# Altium schematic sheet USB_FPC.SchDoc
size A4
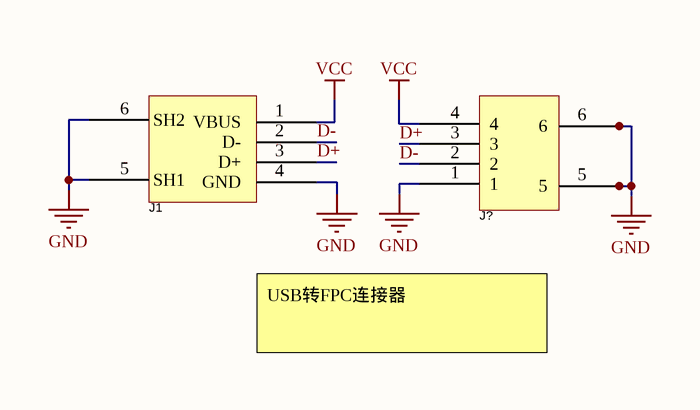
[diagram p0: USB_FPC.SchDoc]

## Parts
J1  U-G-04DD-W-4  [USB-TH_U-G-04DD-W-4]  (value not drawn)
J?  AFC01-S04FCC-00  [FFC-SMD_4P-P0.50_AFC01-S04FCC-00]  (value not drawn)

## Nets
GND: J1.4(GND) J1.5(SH1) J1.6(SH2) J?.1 J?.5 J?.6
VCC: J1.1(VBUS) J?.4
D+: J1.3(D+) J?.3
D-: J1.2(D-) J?.2

## Notes on the sheet
- USB转FPC连接器

## Library data of the parts
J1 = USB U-G-04DD-W-4: 直插式USB-A公头; Manufacturer: 韩国韩荣; Add into BOM: yes; Connector Type: Type-A; Gender: 公; Number of Ports: 1; Number of Contacts: 4P; Symbol: U-G-04DD-W-4; Device: U-G-04DD-W-4; LCSC Part Name: Type-A 公 直插; Supplier Part: C879731; Manufacturer Part: U-G-04DD-W-4; Supplier Footprint: 插件; JLCPCB Part Class: Extended Part; Datasheet: https://atta.szlcsc.com/upload/public/pdf/source/20210810/0A35F1E9B38E7EA5C3EF6C12E1E2A06B.pdf; Supplier: LCSC; Convert to PCB: yes; Standard: USB 2.0; Mounting Style: 直插; Current Rating - Power (Max): -; Operating Temperature Range: -55℃~+85℃
J? = FPC AFC01-S04FCC-00: 4pin FPC接口; Manufacturer: JS(钜硕电子); Add into BOM: yes; Locking Feature: 翻盖式; Number of Contacts: 4P; Pitch: 0.5mm; FFC, FCB Thickness: 0.3mm; Symbol: AFC01-S04FCC-00; Device: AFC01-S04FCC-00; LCSC Part Name: 间距:0.5mm P数:4P 翻盖式 下接; Supplier Part: C262260; Manufacturer Part: AFC01-S04FCC-00; Supplier Footprint: SMD,P=0.5mm,卧贴; JLCPCB Part Class: Extended Part; Datasheet: https://atta.szlcsc.com/upload/public/pdf/source/20190816/C413942_2A72D1AC756EAE17EEDF756A339D4500.pdf; Supplier: LCSC; Convert to PCB: yes; Contact Type: 下接; Mounting Type: 卧贴; Height Above Board: 2mm